# EAGLE board trig3_board_de0-nano (EAGLE 9.2.0), part 1 of 2
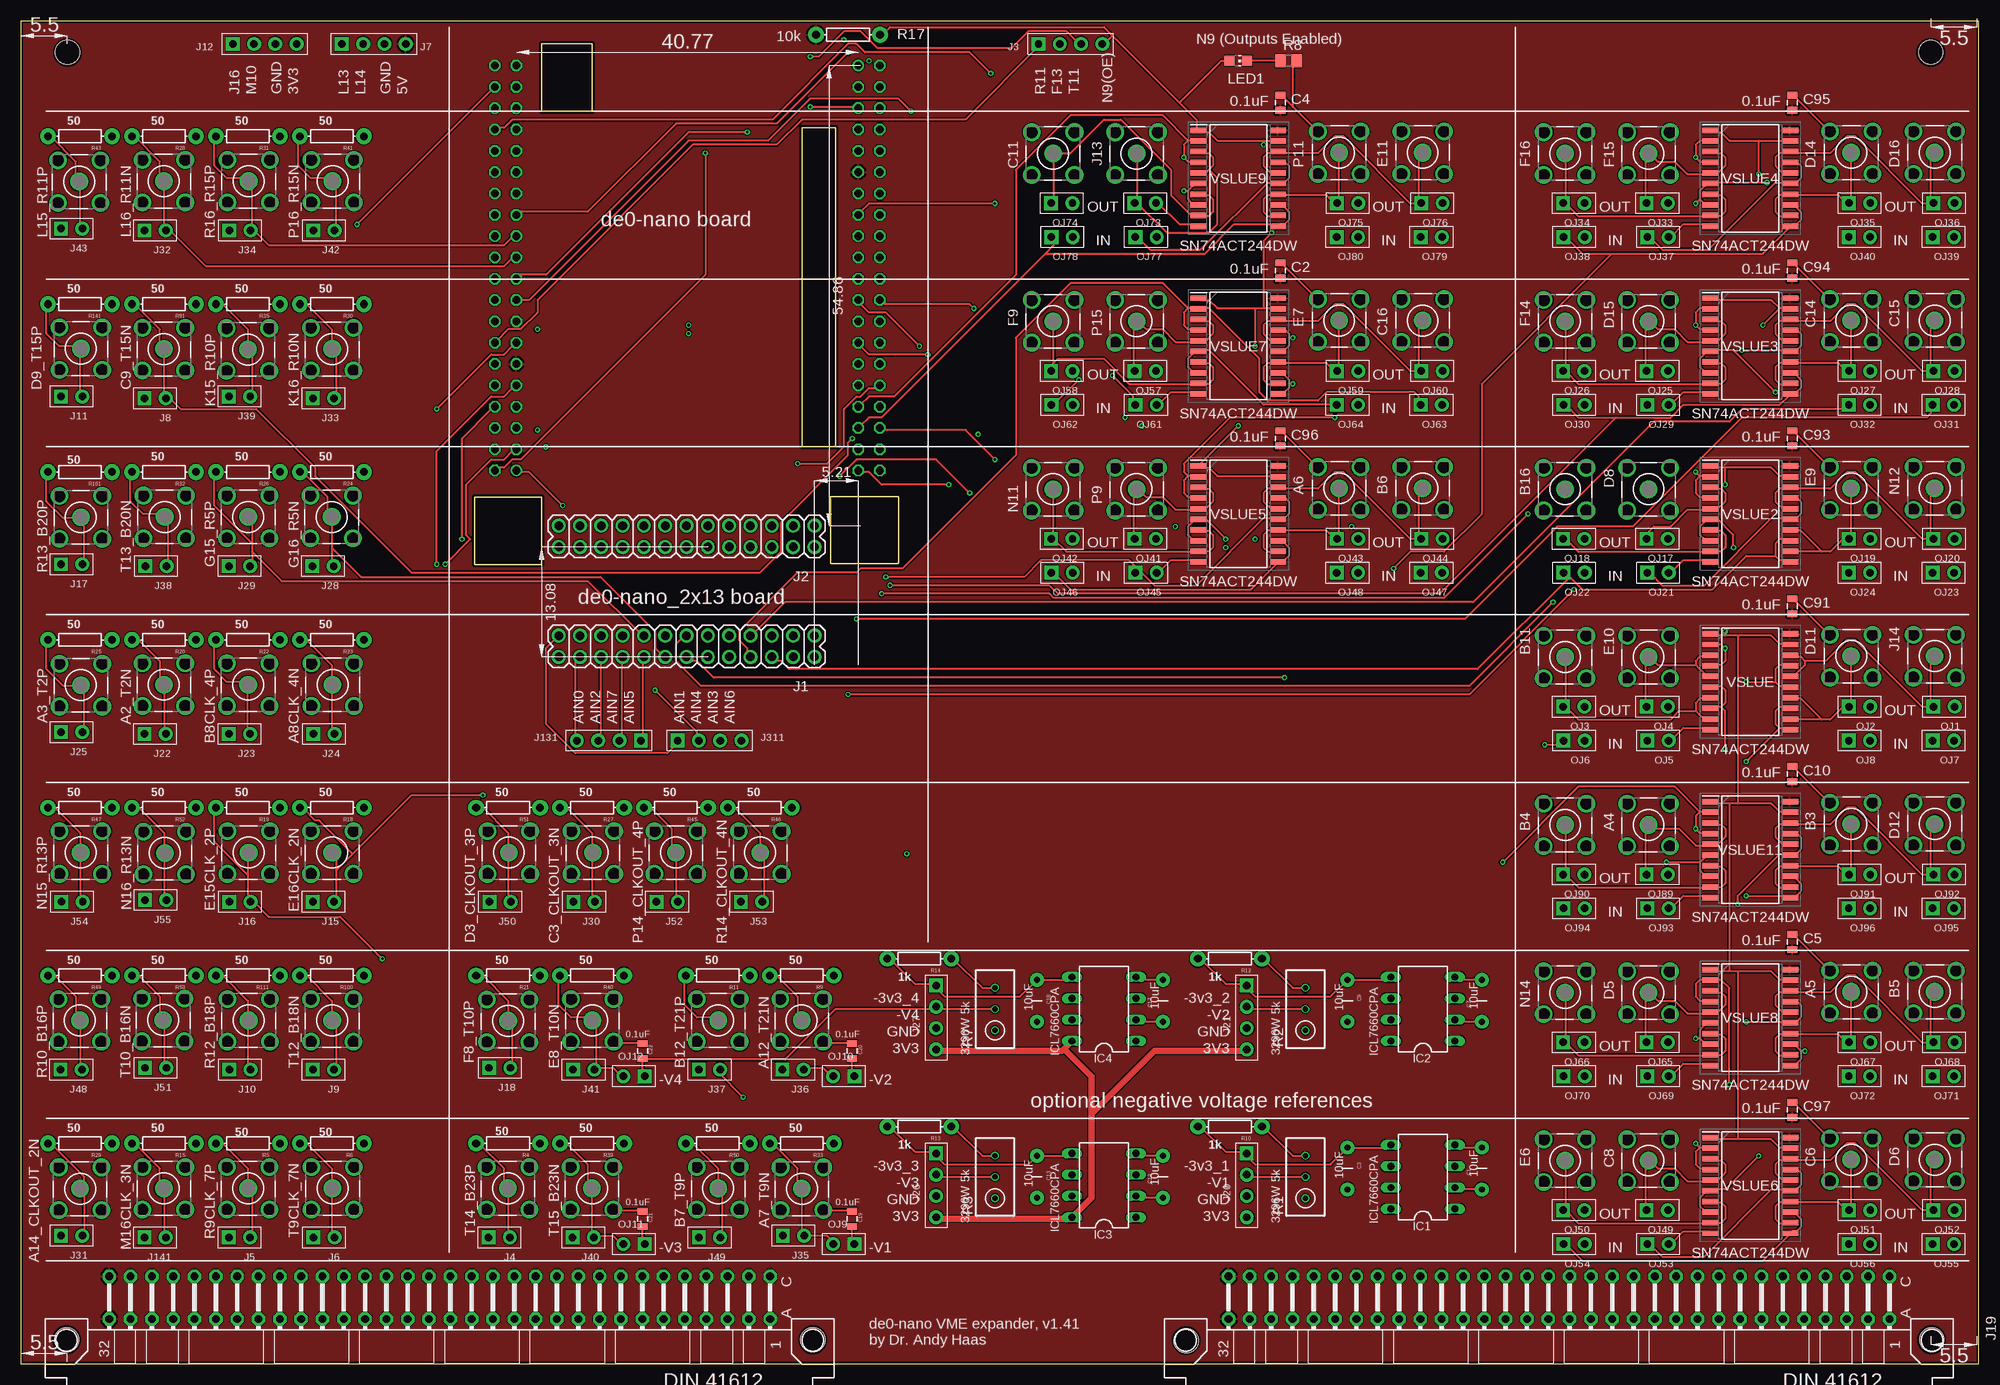
[diagram p5: board, top side]
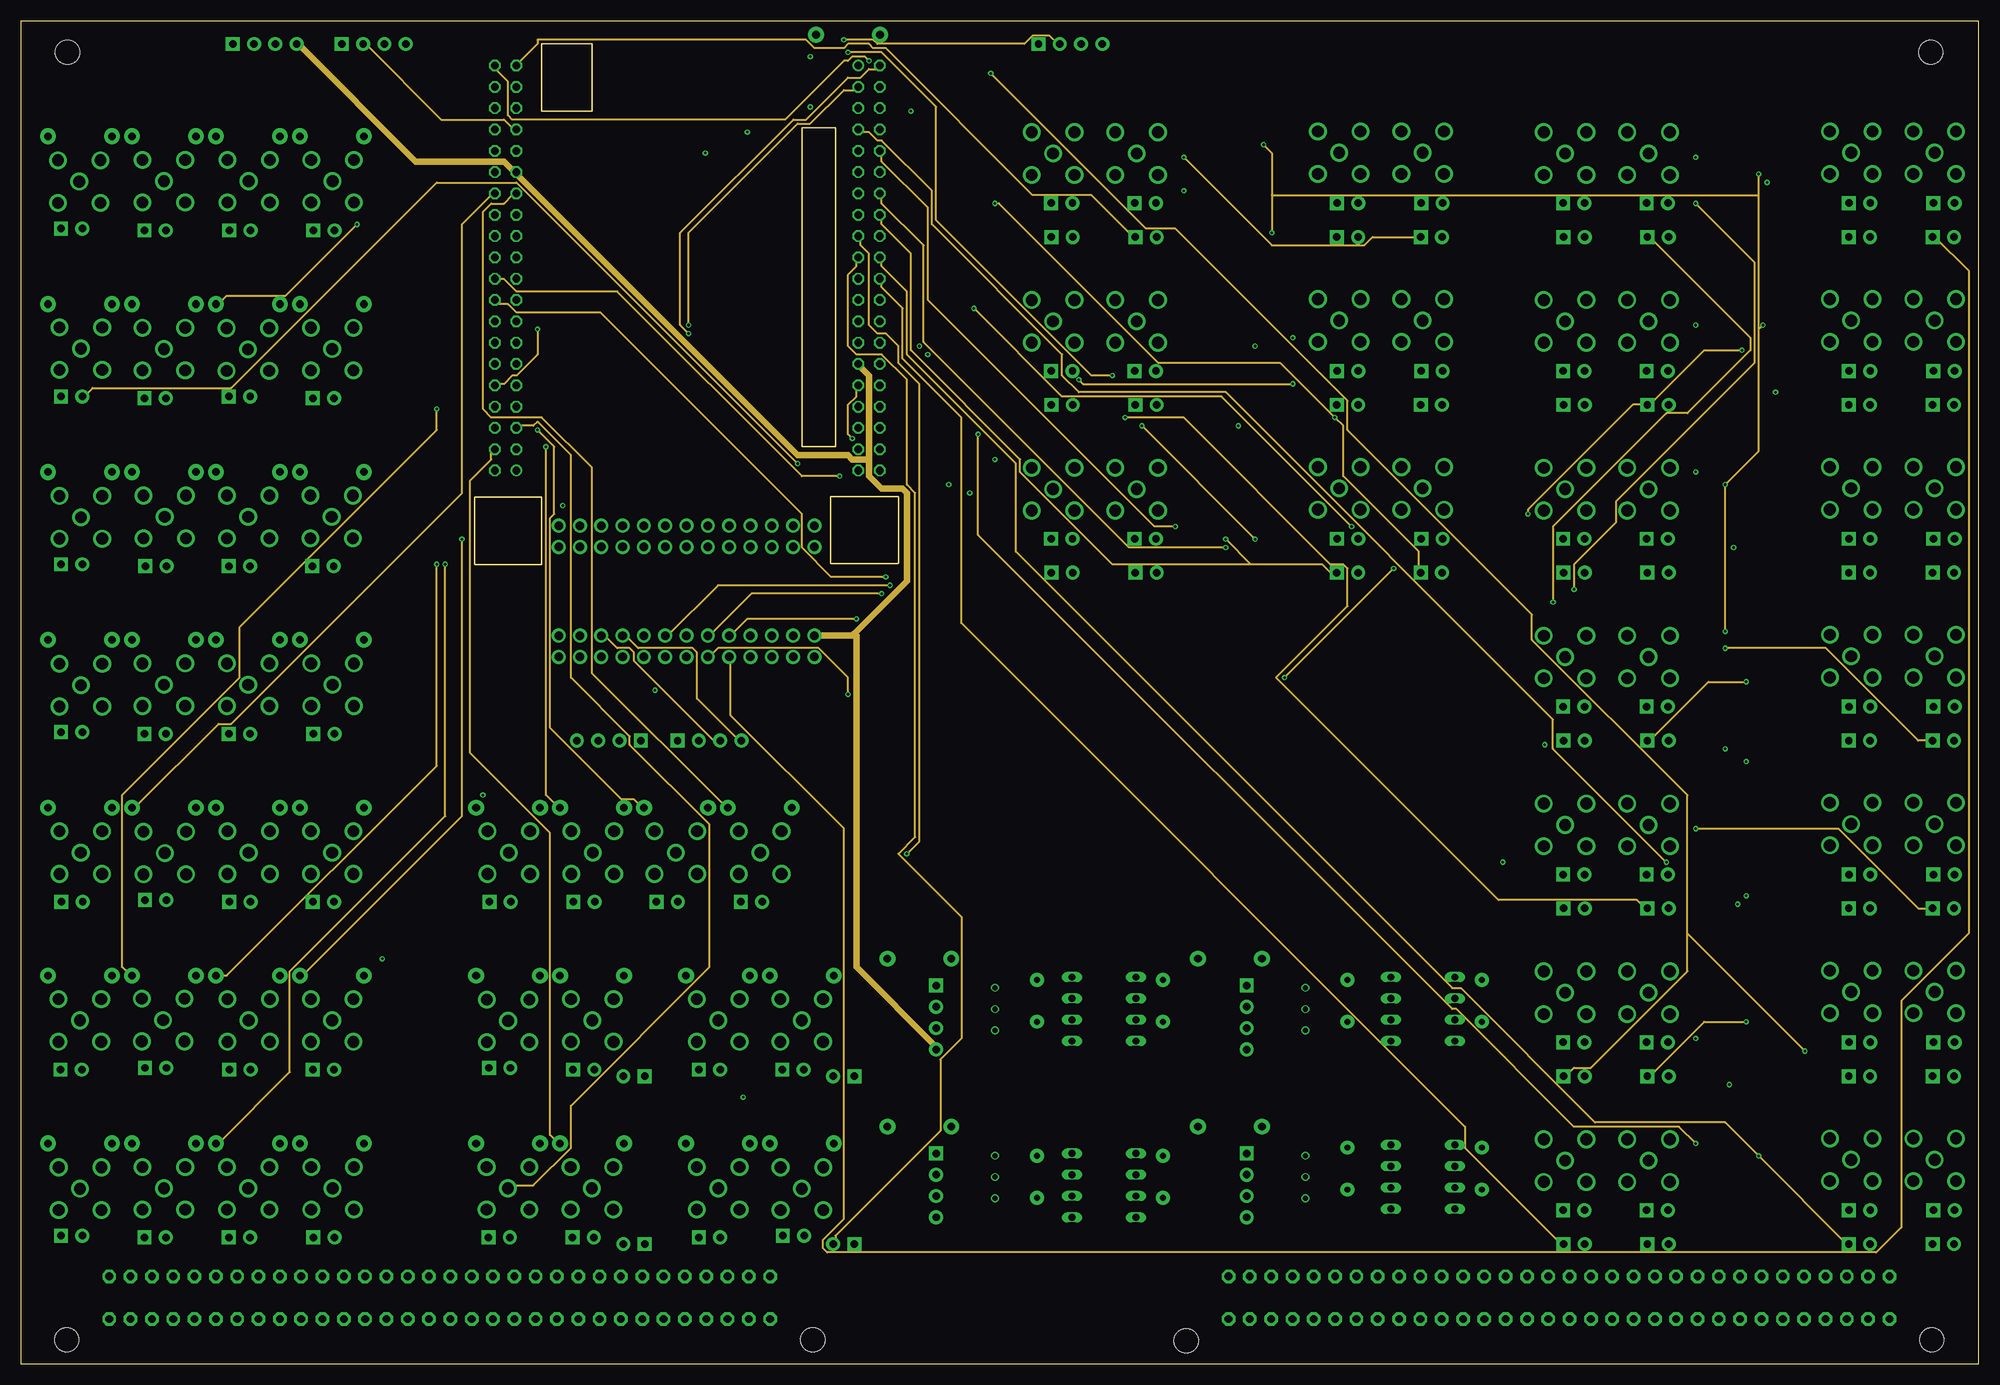
[diagram p6: board, inner layer Route2]
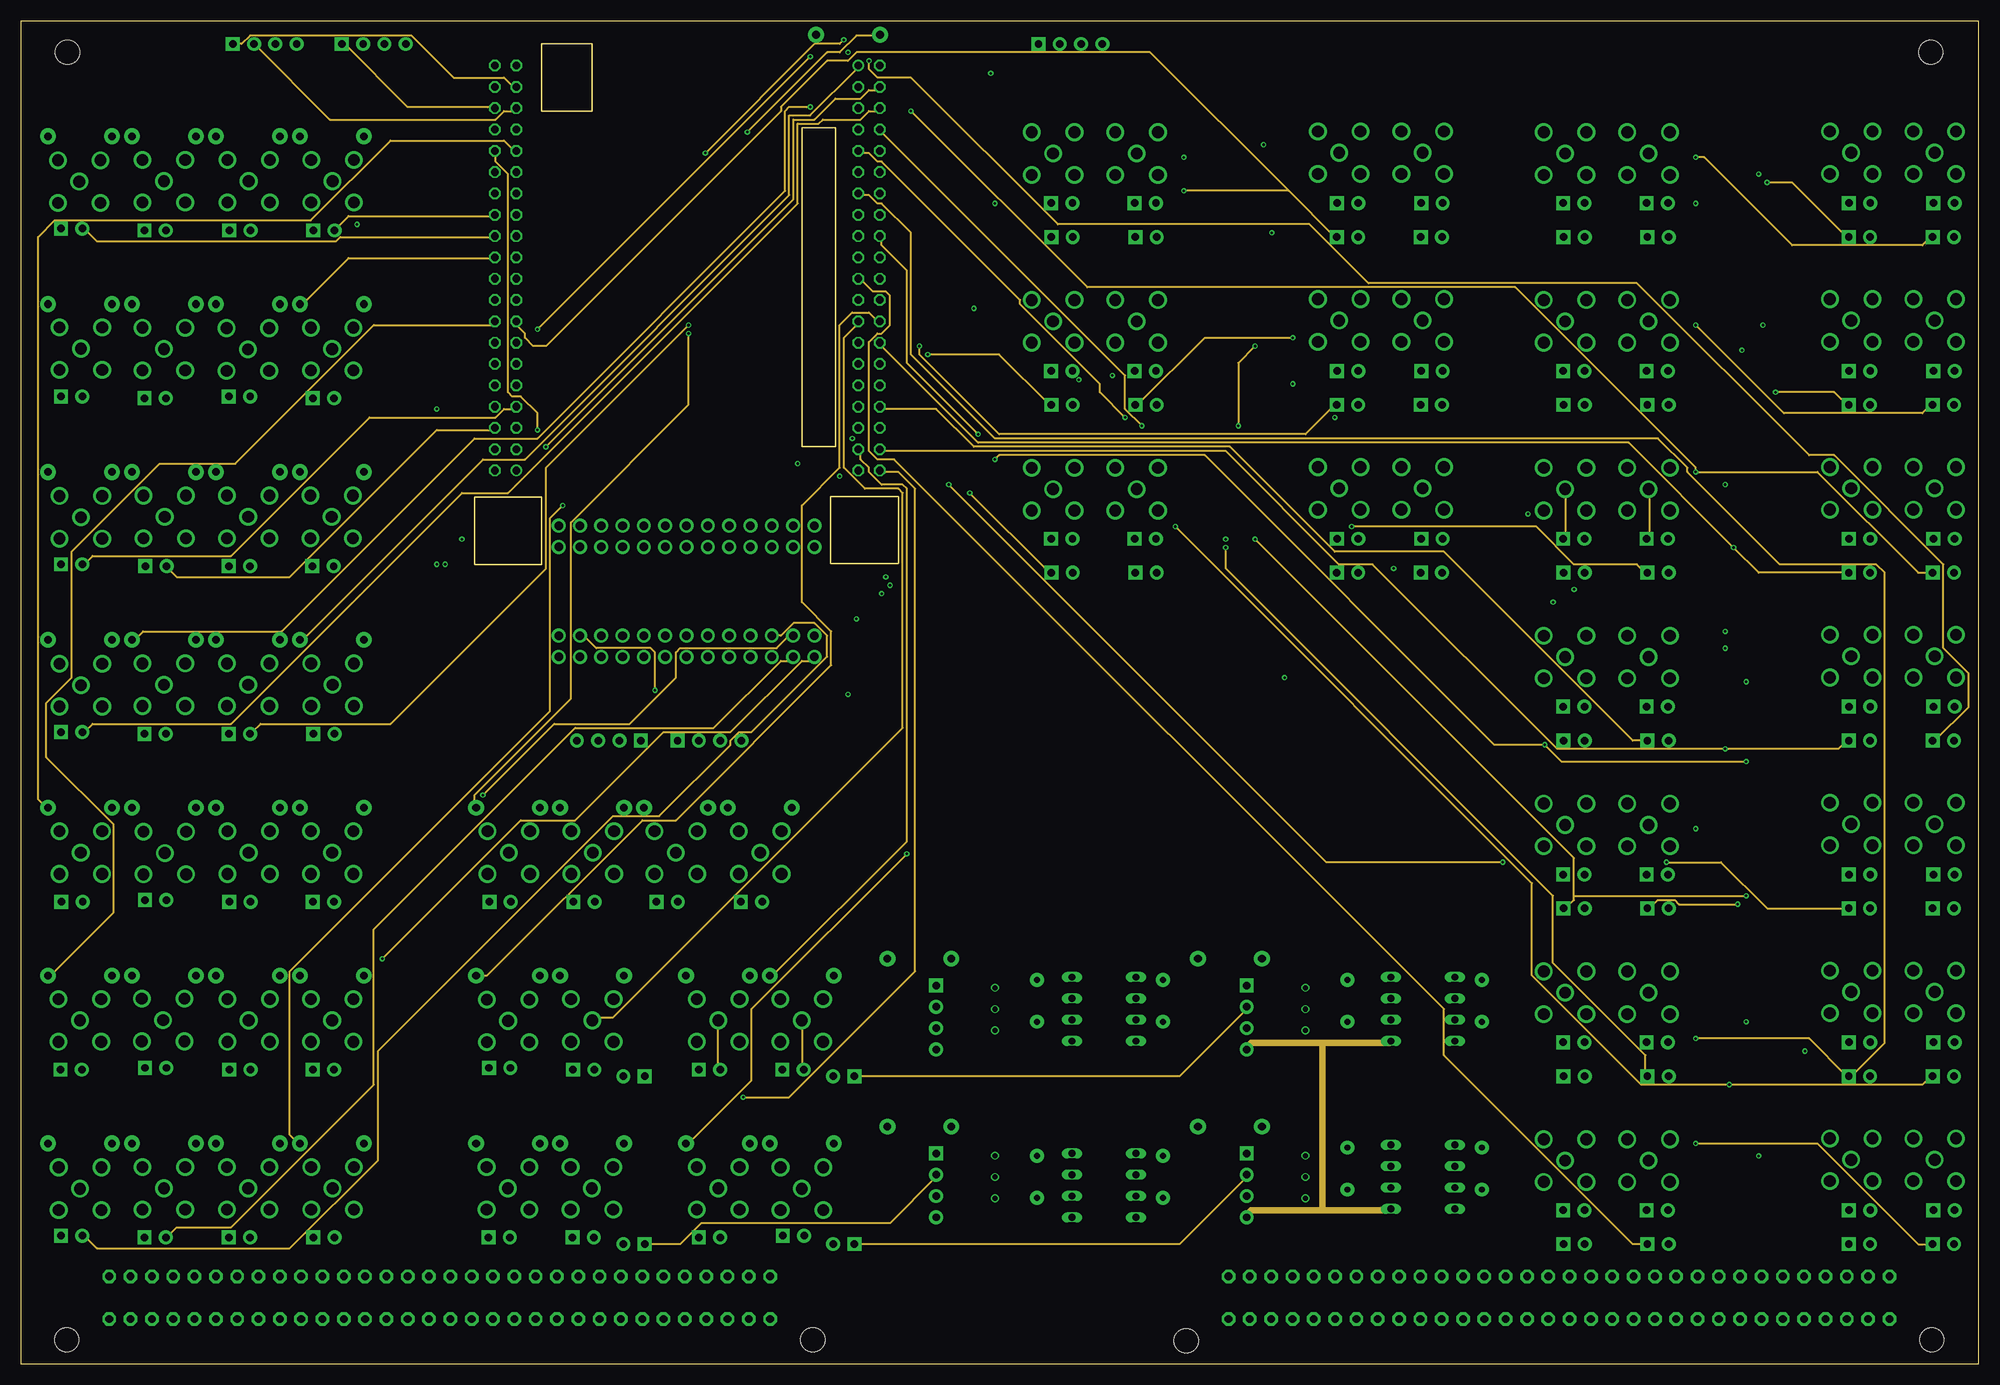
[diagram p7: board, inner layer Route15]
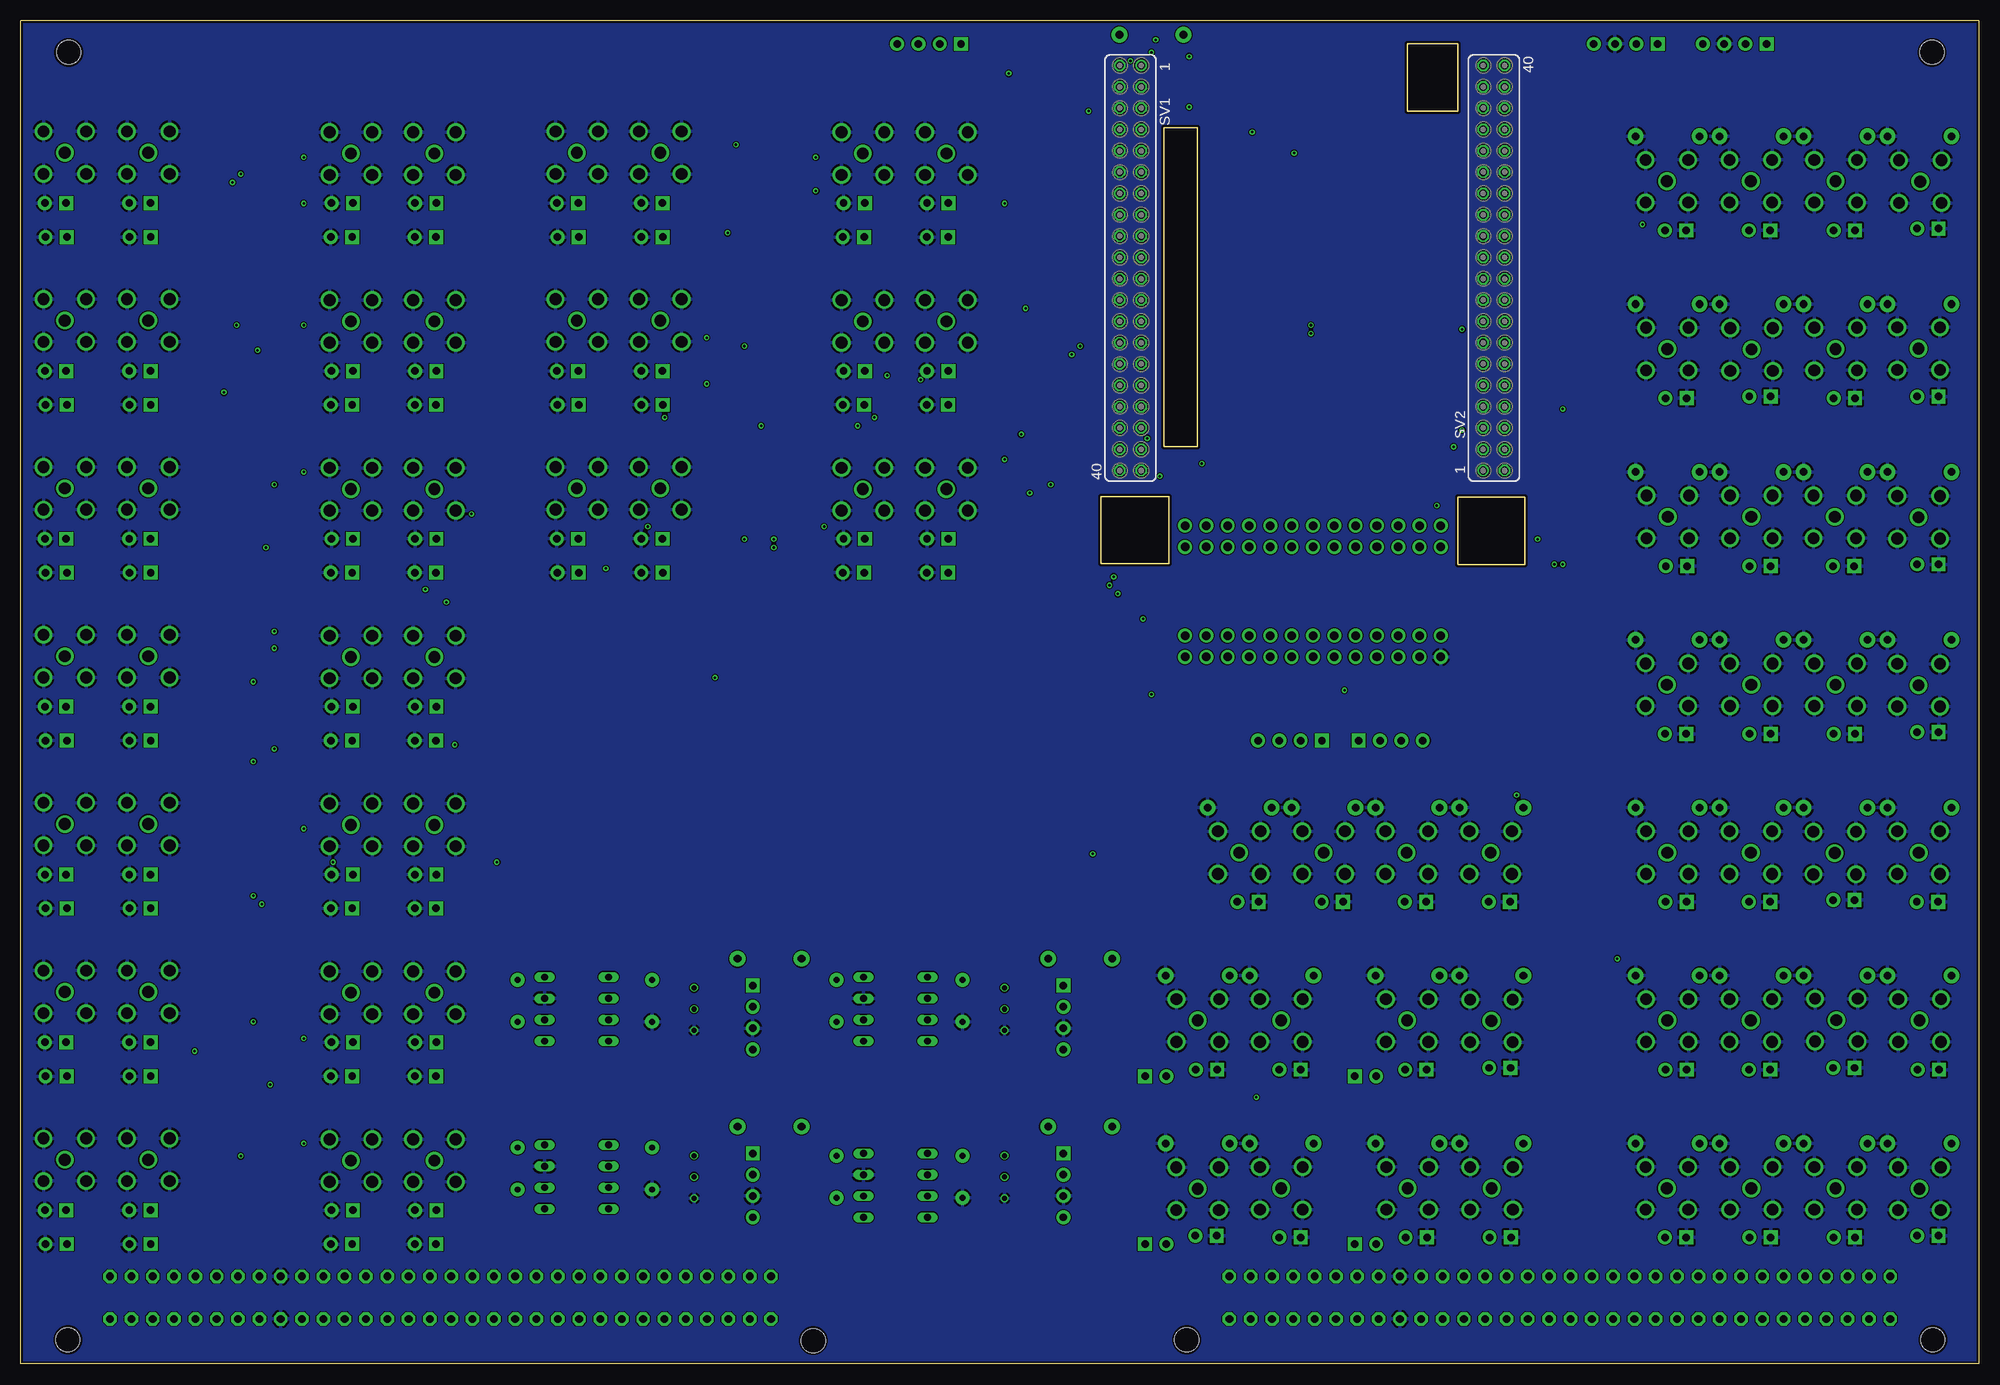
[diagram p8: board, bottom side, seen from below]

Size 233.22 x 160 mm. Coordinates in mm from the lower left corner, seen from the top.
Outline: 104.54,103.36 104.54,95.36 96.44,95.36 96.44,103.36 104.54,103.36
Outline: 62.04,103.26 62.04,95.26 54.04,95.26 54.04,103.26 62.04,103.26
Outline: 97.04,147.26 97.04,109.26 93.04,109.26 93.04,147.26 97.04,147.26
Outline: 62.04,149.26 62.04,157.26 68.04,157.26 68.04,149.26 62.04,149.26
Copper layers (1*2*15*16): Top 0.035mm / dielectric 0.23mm / Route2 0.035mm / dielectric 0.93mm / Route15 0.035mm / dielectric 0.23mm / Bottom 0.035mm
Design rules "MF_Standard_4_Layer": minimum track width 5mil, minimum drill 12mil, track to track 5mil, track to pad 5mil, pad to pad 5mil, via to via 5mil, smd to smd 0mil, copper to edge 10mil, drill to drill 10mil, minimum pad ring 6mil, minimum via ring 6mil, stop-mask expansion 2mil, vias tented up to drill 25mil, thermal gap 10mil
Net classes: 0 default: width 0.254 mm; 1 power: width 0.762 mm
Holes 2.9 mm at 5.44,2.86 138.84,2.76 227.64,2.86 94.34,2.86 5.54,156.26 227.54,156.26

## Footprints (pad centres in the part's own frame; a part is rotated, then mirrored left to right if it is on the bottom)
BU-SMB-V = drill 1.4: 1 0,0; 2 -2.54,2.54; 3 2.54,2.54; 4 2.54,-2.54; 5 -2.54,-2.54
CAP-PTH-5MM = drill 0.7 pad 1.651: 1 -2.5,0; 2 2.5,0
0805 = smd 0.8 x 1.2: 1 -0.9,0; 2 0.9,0
DIL08 = drill 0.813 long: 1 -3.81,-3.81; 2 -1.27,-3.81; 3 1.27,-3.81; 4 3.81,-3.81; 5 3.81,3.81; 6 1.27,3.81; 7 -1.27,3.81; 8 -3.81,3.81
2X13 = drill 1.016 pad 1.651: 1 0,0; 2 0,2.54; 3 2.54,0; 4 2.54,2.54; 5 5.08,0; 6 5.08,2.54; 7 7.62,0; 8 7.62,2.54; 9 10.16,0; 10 10.16,2.54; 11 12.7,0; 12 12.7,2.54; 13 15.24,0; 14 15.24,2.54; 15 17.78,0; 16 17.78,2.54; 17 20.32,0; 18 20.32,2.54; 19 22.86,0; 20 22.86,2.54; 21 25.4,0; 22 25.4,2.54; 23 27.94,0; 24 27.94,2.54; 25 30.48,0; 26 30.48,2.54
H4-2.54 = drill 0.889 pad 1.651 square: 1 0,3.81 | drill 0.889 pad 1.651: 2 0,1.27; 3 0,-1.27; 4 0,-3.81
H2-2.54 = drill 0.889 pad 1.651 square: 1 0,1.27 | drill 0.889 pad 1.651: 2 0,-1.27
6HE_160-VG64AC = drill 0.914 pad 1.6 octagon: 1-A1 5.08,11.43; 1-A2 5.08,16.51; 1-A3 5.08,13.97; 1-A4 5.08,19.05; 1-A5 5.08,21.59; 1-A6 5.08,24.13; 1-A7 5.08,26.67; 1-A8 5.08,29.21; 1-A9 5.08,31.75; 1-A10 5.08,34.29; 1-A11 5.08,36.83; 1-A12 5.08,39.37; 1-A13 5.08,41.91; 1-A14 5.08,44.45; 1-A15 5.08,46.99; 1-A16 5.08,49.53; 1-A17 5.08,52.07; 1-A18 5.08,54.61; 1-A19 5.08,57.15; 1-A20 5.08,59.69; 1-A21 5.08,62.23; 1-A22 5.08,64.77; 1-A23 5.08,67.31; 1-A24 5.08,69.85; 1-A25 5.08,72.39; 1-A26 5.08,74.93; 1-A27 5.08,77.47; 1-A28 5.08,80.01; 1-A29 5.08,82.55; 1-A30 5.08,85.09; 1-A31 5.08,87.63; 1-A32 5.08,90.17; 1-C1 10.16,11.43; 1-C2 10.16,13.97; 1-C3 10.16,16.51; 1-C4 10.16,19.05; 1-C5 10.16,21.59; 1-C6 10.16,24.13; 1-C7 10.16,26.67; 1-C8 10.16,29.21; 1-C9 10.16,31.75; 1-C10 10.16,34.29; 1-C11 10.16,36.83; 1-C12 10.16,39.37; 1-C13 10.16,41.91; 1-C14 10.16,44.45; 1-C15 10.16,46.99; 1-C16 10.16,49.53; 1-C17 10.16,52.07; 1-C18 10.16,54.61; 1-C19 10.16,57.15; 1-C20 10.16,59.69; 1-C21 10.16,62.23; 1-C22 10.16,64.77; 1-C23 10.16,67.31; 1-C24 10.16,69.85; 1-C25 10.16,72.39; 1-C26 10.16,74.93; 1-C27 10.16,77.47; 1-C28 10.16,80.01; 1-C29 10.16,82.55; 1-C30 10.16,85.09; 1-C31 10.16,87.63; 1-C32 10.16,90.17; 2-A1 5.08,144.78; 2-A2 5.08,147.32; 2-A3 5.08,149.86; 2-A4 5.08,152.4; 2-A5 5.08,154.94; 2-A6 5.08,157.48; 2-A7 5.08,160.02; 2-A8 5.08,162.56; 2-A9 5.08,165.1; 2-A10 5.08,167.64; 2-A11 5.08,170.18; 2-A12 5.08,172.72; 2-A13 5.08,175.26; 2-A14 5.08,177.8; 2-A15 5.08,180.34; 2-A16 5.08,182.88; 2-A17 5.08,185.42; 2-A18 5.08,187.96; 2-A19 5.08,190.5; 2-A20 5.08,193.04; 2-A21 5.08,195.58; 2-A22 5.08,198.12; 2-A23 5.08,200.66; 2-A24 5.08,203.2; 2-A25 5.08,205.74; 2-A26 5.08,208.28; 2-A27 5.08,210.82; 2-A28 5.08,213.36; 2-A29 5.08,215.9; 2-A30 5.08,218.44; 2-A31 5.08,220.98; 2-A32 5.08,223.52; 2-C1 10.16,144.78; 2-C2 10.16,147.32; 2-C3 10.16,149.86; 2-C4 10.16,152.4; 2-C5 10.16,154.94; 2-C6 10.16,157.48; 2-C7 10.16,160.02; 2-C8 10.16,162.56; 2-C9 10.16,165.1; 2-C10 10.16,167.64; 2-C11 10.16,170.18; 2-C12 10.16,172.72; 2-C13 10.16,175.26; 2-C14 10.16,177.8; 2-C15 10.16,180.34; 2-C16 10.16,182.88; 2-C17 10.16,185.42; 2-C18 10.16,187.96; 2-C19 10.16,190.5; 2-C20 10.16,193.04; 2-C21 10.16,195.58; 2-C22 10.16,198.12; 2-C23 10.16,200.66; 2-C24 10.16,203.2; 2-C25 10.16,205.74; 2-C26 10.16,208.28; 2-C27 10.16,210.82; 2-C28 10.16,213.36; 2-C29 10.16,215.9; 2-C30 10.16,218.44; 2-C31 10.16,220.98; 2-C32 10.16,223.52
CHIP-LED0805 = smd 1.2 x 1.2: A 0,-1.05; C 0,1.05
RTRIM3296W = drill 0.61: 1 0,-2.54; 2 0,0; 3 0,2.54
AXIAL-0.3 = drill 0.9 pad 1.88: P$1 -3.81,0; P$2 3.81,0
R0805 = smd 1.3 x 1.5: 1 -0.95,0; 2 0.95,0
FE20-2 = drill 0.914: 1 -24.13,1.27 | drill 0.914 octagon: 2 -24.13,-1.27; 3 -21.59,1.27; 4 -21.59,-1.27; 5 -19.05,1.27; 6 -19.05,-1.27; 7 -16.51,1.27; 8 -16.51,-1.27; 9 -13.97,1.27; 10 -13.97,-1.27; 11 -11.43,1.27; 12 -11.43,-1.27; 13 -8.89,1.27; 14 -8.89,-1.27; 15 -6.35,1.27; 16 -6.35,-1.27; 17 -3.81,1.27; 18 -3.81,-1.27; 19 -1.27,1.27; 20 -1.27,-1.27; 21 1.27,1.27; 22 1.27,-1.27; 23 3.81,1.27; 24 3.81,-1.27; 25 6.35,1.27; 26 6.35,-1.27; 27 8.89,1.27; 28 8.89,-1.27; 29 11.43,1.27; 30 11.43,-1.27; 31 13.97,1.27; 32 13.97,-1.27; 33 16.51,1.27; 34 16.51,-1.27; 35 19.05,1.27; 36 19.05,-1.27; 37 21.59,1.27; 38 21.59,-1.27; 39 24.13,1.27; 40 24.13,-1.27
SOIC127P1030X265-20N = smd 1.95 x 0.65: 1 -4.725,5.715; 2 -4.725,4.445; 3 -4.725,3.175; 4 -4.725,1.905; 5 -4.725,0.635; 6 -4.725,-0.635; 7 -4.725,-1.905; 8 -4.725,-3.175; 9 -4.725,-4.445; 10 -4.725,-5.715; 11 4.725,-5.715; 12 4.725,-4.445; 13 4.725,-3.175; 14 4.725,-1.905; 15 4.725,-0.635; 16 4.725,0.635; 17 4.725,1.905; 18 4.725,3.175; 19 4.725,4.445; 20 4.725,5.715

## Placement (x,y rotation side)
A2_T2N  BU-SMB-V  [BU-SMB-V]  17.02,80.91 180 top
A3_T2P  BU-SMB-V  [BU-SMB-V]  7.14,80.86 180 top
A4  BU-SMB-V  [BU-SMB-V]  193.92,64.21 180 top
A5  BU-SMB-V  [BU-SMB-V]  218.05,44.31 0 top
A6  BU-SMB-V  [BU-SMB-V]  157.05,104.31 0 top
A7_T9N  BU-SMB-V  [BU-SMB-V]  93.04,20.86 180 top
A8CLK_4N  BU-SMB-V  [BU-SMB-V]  37.12,80.91 180 top
A12_T21N  BU-SMB-V  [BU-SMB-V]  93.02,40.91 180 top
A14_CLKOUT_2N  BU-SMB-V  [BU-SMB-V]  7.04,20.86 180 top
B3  BU-SMB-V  [BU-SMB-V]  218.05,64.31 0 top
B4  BU-SMB-V  [BU-SMB-V]  183.97,64.21 180 top
B5  BU-SMB-V  [BU-SMB-V]  228,44.31 0 top
B6  BU-SMB-V  [BU-SMB-V]  167,104.31 0 top
B7_T9P  BU-SMB-V  [BU-SMB-V]  83.07,20.91 180 top
B8CLK_4P  BU-SMB-V  [BU-SMB-V]  27.07,80.91 180 top
B11  BU-SMB-V  [BU-SMB-V]  183.97,84.21 180 top
B12_T21P  BU-SMB-V  [BU-SMB-V]  83.07,40.91 180 top
B16  BU-SMB-V  [BU-SMB-V]  183.97,104.21 180 top
C1  10uF  [CAP-PTH-5MM]  174.04,23.26 90 top
C2  0.1uF  [0805]  150.04,130.26 270 top
C3  10uF  [CAP-PTH-5MM]  158.04,23.26 270 top
C3_CLKOUT_3N  BU-SMB-V  [BU-SMB-V]  68.12,60.91 180 top
C4  0.1uF  [0805]  150.04,150.26 270 top
C5  0.1uF  [0805]  211.04,50.26 270 top
C6  BU-SMB-V  [BU-SMB-V]  218.05,24.31 0 top
C7  10uF  [CAP-PTH-5MM]  174.04,43.26 90 top
C8  BU-SMB-V  [BU-SMB-V]  193.92,24.21 180 top
C9  10uF  [CAP-PTH-5MM]  158.04,43.26 270 top
C9_T15N  BU-SMB-V  [BU-SMB-V]  17.02,120.91 180 top
C10  0.1uF  [0805]  211.04,70.26 270 top
C11  BU-SMB-V  [BU-SMB-V]  122.97,144.21 180 top
C12  10uF  [CAP-PTH-5MM]  136.04,22.26 90 top
C13  10uF  [CAP-PTH-5MM]  121.04,22.26 270 top
C14  BU-SMB-V  [BU-SMB-V]  218.05,124.31 0 top
C15  BU-SMB-V  [BU-SMB-V]  228,124.31 0 top
C16  BU-SMB-V  [BU-SMB-V]  167,124.31 0 top
C17  10uF  [CAP-PTH-5MM]  136.04,43.26 90 top
C18  10uF  [CAP-PTH-5MM]  121.04,43.26 270 top
C19  0.1uF  [0805]  99.04,17.26 270 top
C20  0.1uF  [0805]  99.04,37.26 270 top
C21  0.1uF  [0805]  74.04,17.26 270 top
C22  0.1uF  [0805]  74.04,37.26 270 top
C91  0.1uF  [0805]  211.04,90.26 270 top
C93  0.1uF  [0805]  211.04,110.26 270 top
C94  0.1uF  [0805]  211.04,130.26 270 top
C95  0.1uF  [0805]  211.04,150.26 270 top
C96  0.1uF  [0805]  150.04,110.26 270 top
C97  0.1uF  [0805]  211.04,30.26 270 top
D3_CLKOUT_3P  BU-SMB-V  [BU-SMB-V]  58.12,60.91 180 top
D5  BU-SMB-V  [BU-SMB-V]  193.92,44.21 180 top
D6  BU-SMB-V  [BU-SMB-V]  228,24.31 0 top
D8  BU-SMB-V  [BU-SMB-V]  193.92,104.21 180 top
D9_T15P  BU-SMB-V  [BU-SMB-V]  7.14,120.96 180 top
D11  BU-SMB-V  [BU-SMB-V]  218.05,84.31 0 top
D12  BU-SMB-V  [BU-SMB-V]  228,64.31 0 top
D14  BU-SMB-V  [BU-SMB-V]  218.05,144.31 0 top
D15  BU-SMB-V  [BU-SMB-V]  193.92,124.21 180 top
D16  BU-SMB-V  [BU-SMB-V]  228,144.31 0 top
E6  BU-SMB-V  [BU-SMB-V]  183.97,24.21 180 top
E7  BU-SMB-V  [BU-SMB-V]  157.05,124.31 0 top
E8_T10N  BU-SMB-V  [BU-SMB-V]  68.07,40.91 180 top
E9  BU-SMB-V  [BU-SMB-V]  218.05,104.31 0 top
E10  BU-SMB-V  [BU-SMB-V]  193.92,84.21 180 top
E11  BU-SMB-V  [BU-SMB-V]  167,144.31 0 top
E15CLK_2P  BU-SMB-V  [BU-SMB-V]  27.12,60.91 180 top
E16CLK_2N  BU-SMB-V  [BU-SMB-V]  37.07,60.91 180 top
F8_T10P  BU-SMB-V  [BU-SMB-V]  58.04,40.86 180 top
F9  BU-SMB-V  [BU-SMB-V]  122.97,124.21 180 top
F14  BU-SMB-V  [BU-SMB-V]  183.97,124.21 180 top
F15  BU-SMB-V  [BU-SMB-V]  193.92,144.21 180 top
F16  BU-SMB-V  [BU-SMB-V]  183.97,144.21 180 top
G15_R5P  BU-SMB-V  [BU-SMB-V]  27.07,100.91 180 top
G16_R5N  BU-SMB-V  [BU-SMB-V]  37.02,100.91 180 top
IC1  ICL7660CPA  [DIL08]  167.04,22.26 90 top
IC2  ICL7660CPA  [DIL08]  167.04,42.26 90 top
IC3  ICL7660CPA  [DIL08]  129.04,21.26 90 top
IC4  ICL7660CPA  [DIL08]  129.04,42.26 90 top
J1  [2X13]  94.54,86.76 180 top
J2  [2X13]  94.54,99.86 180 top
J3  4p-2.54  [H4-2.54]  125.04,157.26 90 top
J4  2p-2.54  [H2-2.54]  56.98,15.05 90 top
J5  2p-2.54  [H2-2.54]  26.03,15.05 90 top
J6  2p-2.54  [H2-2.54]  36.09,15.05 90 top
J7  4p-2.54  [H4-2.54]  42.04,157.26 90 top
J8  2p-2.54  [H2-2.54]  15.98,115.05 90 top
J9  2p-2.54  [H2-2.54]  36.03,35.05 90 top
J10  2p-2.54  [H2-2.54]  26.09,35.05 90 top
J11  2p-2.54  [H2-2.54]  6.04,115.26 90 top
J12  4p-2.54  [H4-2.54]  29.04,157.26 90 top
J13  BU-SMB-V  [BU-SMB-V]  132.92,144.21 180 top
J14  BU-SMB-V  [BU-SMB-V]  228,84.31 0 top
J15  2p-2.54  [H2-2.54]  36.03,55.05 90 top
J16  2p-2.54  [H2-2.54]  26.09,55.05 90 top
J17  2p-2.54  [H2-2.54]  6.04,95.26 90 top
J18  2p-2.54  [H2-2.54]  57.04,35.26 90 top
J19  6HE-160-VG64AC  [6HE_160-VG64AC]  234.04,0.26 90 top
J20  4p-2.54  [H4-2.54]  146.04,21.26 0 top
J21  4p-2.54  [H4-2.54]  146.04,41.26 0 top
J22  2p-2.54  [H2-2.54]  15.98,75.05 90 top
J23  2p-2.54  [H2-2.54]  26.03,75.05 90 top
J24  2p-2.54  [H2-2.54]  36.09,75.05 90 top
J25  2p-2.54  [H2-2.54]  6.04,75.26 90 top
J26  4p-2.54  [H4-2.54]  109.04,21.26 0 top
J27  4p-2.54  [H4-2.54]  109.04,41.26 0 top
J28  2p-2.54  [H2-2.54]  35.98,95.05 90 top
J29  2p-2.54  [H2-2.54]  26.03,95.05 90 top
J30  2p-2.54  [H2-2.54]  67.09,55.05 90 top
J31  2p-2.54  [H2-2.54]  6.04,15.26 90 top
J32  2p-2.54  [H2-2.54]  15.98,135.05 90 top
J33  2p-2.54  [H2-2.54]  36.03,115.05 90 top
J34  2p-2.54  [H2-2.54]  26.09,135.05 90 top
J35  2p-2.54  [H2-2.54]  92.04,15.26 90 top
J36  2p-2.54  [H2-2.54]  91.98,35.05 90 top
J37  2p-2.54  [H2-2.54]  82.03,35.05 90 top
J38  2p-2.54  [H2-2.54]  16.09,95.05 90 top
J39  2p-2.54  [H2-2.54]  26.04,115.26 90 top
J40  2p-2.54  [H2-2.54]  66.98,15.05 90 top
J41  2p-2.54  [H2-2.54]  67.03,35.05 90 top
J42  2p-2.54  [H2-2.54]  36.09,135.05 90 top
J43  2p-2.54  [H2-2.54]  6.04,135.26 90 top
J48  2p-2.54  [H2-2.54]  5.98,35.05 90 top
J49  2p-2.54  [H2-2.54]  82.03,15.05 90 top
J50  2p-2.54  [H2-2.54]  57.09,55.05 90 top
J51  2p-2.54  [H2-2.54]  16.04,35.26 90 top
J52  2p-2.54  [H2-2.54]  76.98,55.05 90 top
J53  2p-2.54  [H2-2.54]  87.03,55.05 90 top
J54  2p-2.54  [H2-2.54]  6.09,55.05 90 top
J55  2p-2.54  [H2-2.54]  16.04,55.26 90 top
J131  4p-2.54  [H4-2.54]  70.04,74.26 270 top
J141  2p-2.54  [H2-2.54]  15.98,15.05 90 top
J311  4p-2.54  [H4-2.54]  82.04,74.26 90 top
K15_R10P  BU-SMB-V  [BU-SMB-V]  27.04,120.86 180 top
K16_R10N  BU-SMB-V  [BU-SMB-V]  37.07,120.91 180 top
L15_R11P  BU-SMB-V  [BU-SMB-V]  6.94,140.86 180 top
L16_R11N  BU-SMB-V  [BU-SMB-V]  17.02,140.91 180 top
LED1  red  [CHIP-LED0805]  145.04,155.26 270 top
M16CLK_3N  BU-SMB-V  [BU-SMB-V]  17.02,20.91 180 top
N11  BU-SMB-V  [BU-SMB-V]  122.97,104.21 180 top
N12  BU-SMB-V  [BU-SMB-V]  228,104.31 0 top
N14  BU-SMB-V  [BU-SMB-V]  183.97,44.21 180 top
N15_R13P  BU-SMB-V  [BU-SMB-V]  7.12,60.91 180 top
N16_R13N  BU-SMB-V  [BU-SMB-V]  17.14,60.86 180 top
OJ1  2p-2.54  [H2-2.54]  229.11,78.3 90 top
OJ2  2p-2.54  [H2-2.54]  219.06,78.3 90 top
OJ3  2p-2.54  [H2-2.54]  185,78.3 90 top
OJ4  2p-2.54  [H2-2.54]  194.95,78.3 90 top
OJ5  2p-2.54  [H2-2.54]  195.04,74.26 90 top
OJ6  2p-2.54  [H2-2.54]  185.04,74.26 90 top
OJ7  2p-2.54  [H2-2.54]  229.04,74.26 90 top
OJ8  2p-2.54  [H2-2.54]  219.04,74.26 90 top
OJ9  2p-2.54  [H2-2.54]  98.04,14.26 270 top
OJ10  2p-2.54  [H2-2.54]  98.04,34.26 270 top
OJ11  2p-2.54  [H2-2.54]  73.04,14.26 270 top
OJ12  2p-2.54  [H2-2.54]  73.04,34.26 270 top
OJ17  2p-2.54  [H2-2.54]  194.95,98.3 90 top
OJ18  2p-2.54  [H2-2.54]  185,98.3 90 top
OJ19  2p-2.54  [H2-2.54]  219.06,98.3 90 top
OJ20  2p-2.54  [H2-2.54]  229.11,98.3 90 top
OJ21  2p-2.54  [H2-2.54]  195.04,94.26 90 top
OJ22  2p-2.54  [H2-2.54]  185.04,94.26 90 top
OJ23  2p-2.54  [H2-2.54]  229.04,94.26 90 top
OJ24  2p-2.54  [H2-2.54]  219.04,94.26 90 top
OJ25  2p-2.54  [H2-2.54]  194.95,118.3 90 top
OJ26  2p-2.54  [H2-2.54]  185,118.3 90 top
OJ27  2p-2.54  [H2-2.54]  219.06,118.3 90 top
OJ28  2p-2.54  [H2-2.54]  229.11,118.3 90 top
OJ29  2p-2.54  [H2-2.54]  195.04,114.26 90 top
OJ30  2p-2.54  [H2-2.54]  185.04,114.26 90 top
OJ31  2p-2.54  [H2-2.54]  229.04,114.26 90 top
OJ32  2p-2.54  [H2-2.54]  219.04,114.26 90 top
OJ33  2p-2.54  [H2-2.54]  194.95,138.3 90 top
OJ34  2p-2.54  [H2-2.54]  185,138.3 90 top
OJ35  2p-2.54  [H2-2.54]  219.06,138.3 90 top
OJ36  2p-2.54  [H2-2.54]  229.11,138.3 90 top
OJ37  2p-2.54  [H2-2.54]  195.04,134.26 90 top
OJ38  2p-2.54  [H2-2.54]  185.04,134.26 90 top
OJ39  2p-2.54  [H2-2.54]  229.04,134.26 90 top
OJ40  2p-2.54  [H2-2.54]  219.04,134.26 90 top
OJ41  2p-2.54  [H2-2.54]  133.95,98.3 90 top
OJ42  2p-2.54  [H2-2.54]  124,98.3 90 top
OJ43  2p-2.54  [H2-2.54]  158.06,98.3 90 top
OJ44  2p-2.54  [H2-2.54]  168.11,98.3 90 top
OJ45  2p-2.54  [H2-2.54]  134.04,94.26 90 top
OJ46  2p-2.54  [H2-2.54]  124.04,94.26 90 top
OJ47  2p-2.54  [H2-2.54]  168.04,94.26 90 top
OJ48  2p-2.54  [H2-2.54]  158.04,94.26 90 top
OJ49  2p-2.54  [H2-2.54]  194.95,18.3 90 top
OJ50  2p-2.54  [H2-2.54]  185,18.3 90 top
OJ51  2p-2.54  [H2-2.54]  219.06,18.3 90 top
OJ52  2p-2.54  [H2-2.54]  229.11,18.3 90 top
OJ53  2p-2.54  [H2-2.54]  195.04,14.26 90 top
OJ54  2p-2.54  [H2-2.54]  185.04,14.26 90 top
OJ55  2p-2.54  [H2-2.54]  229.04,14.26 90 top
OJ56  2p-2.54  [H2-2.54]  219.04,14.26 90 top
OJ57  2p-2.54  [H2-2.54]  133.95,118.3 90 top
OJ58  2p-2.54  [H2-2.54]  124,118.3 90 top
OJ59  2p-2.54  [H2-2.54]  158.06,118.3 90 top
OJ60  2p-2.54  [H2-2.54]  168.11,118.3 90 top
OJ61  2p-2.54  [H2-2.54]  134.04,114.26 90 top
OJ62  2p-2.54  [H2-2.54]  124.04,114.26 90 top
OJ63  2p-2.54  [H2-2.54]  168.04,114.26 90 top
OJ64  2p-2.54  [H2-2.54]  158.04,114.26 90 top
OJ65  2p-2.54  [H2-2.54]  194.95,38.3 90 top
OJ66  2p-2.54  [H2-2.54]  185,38.3 90 top
OJ67  2p-2.54  [H2-2.54]  219.06,38.3 90 top
OJ68  2p-2.54  [H2-2.54]  229.11,38.3 90 top
OJ69  2p-2.54  [H2-2.54]  195.04,34.26 90 top
OJ70  2p-2.54  [H2-2.54]  185.04,34.26 90 top
OJ71  2p-2.54  [H2-2.54]  229.04,34.26 90 top
OJ72  2p-2.54  [H2-2.54]  219.04,34.26 90 top
OJ73  2p-2.54  [H2-2.54]  133.95,138.3 90 top
OJ74  2p-2.54  [H2-2.54]  124,138.3 90 top
OJ75  2p-2.54  [H2-2.54]  158.06,138.3 90 top
OJ76  2p-2.54  [H2-2.54]  168.11,138.3 90 top
OJ77  2p-2.54  [H2-2.54]  134.04,134.26 90 top
OJ78  2p-2.54  [H2-2.54]  124.04,134.26 90 top
OJ79  2p-2.54  [H2-2.54]  168.04,134.26 90 top
OJ80  2p-2.54  [H2-2.54]  158.04,134.26 90 top
OJ89  2p-2.54  [H2-2.54]  194.95,58.3 90 top
OJ90  2p-2.54  [H2-2.54]  185,58.3 90 top
OJ91  2p-2.54  [H2-2.54]  219.06,58.3 90 top
OJ92  2p-2.54  [H2-2.54]  229.11,58.3 90 top
OJ93  2p-2.54  [H2-2.54]  195.04,54.26 90 top
OJ94  2p-2.54  [H2-2.54]  185.04,54.26 90 top
OJ95  2p-2.54  [H2-2.54]  229.04,54.26 90 top
OJ96  2p-2.54  [H2-2.54]  219.04,54.26 90 top
P9  BU-SMB-V  [BU-SMB-V]  132.92,104.21 180 top
P11  BU-SMB-V  [BU-SMB-V]  157.05,144.31 0 top
P14_CLKOUT_4P  BU-SMB-V  [BU-SMB-V]  78.02,60.91 180 top
P15  BU-SMB-V  [BU-SMB-V]  132.92,124.21 180 top
P16_R15N  BU-SMB-V  [BU-SMB-V]  37.12,140.91 180 top
R1  3296W 5k  [RTRIM3296W]  153.04,22.26 0 top
R2  3296W 5k  [RTRIM3296W]  153.04,42.26 0 top
R3  3296W 5k  [RTRIM3296W]  116.04,22.26 0 top
R4  50  [AXIAL-0.3]  58.04,26.26 180 top
R5  50  [AXIAL-0.3]  27.04,26.26 180 top
R6  50  [AXIAL-0.3]  37.04,26.26 180 top
R7  3296W 5k  [RTRIM3296W]  116.04,42.26 0 top
R8  560  [R0805]  151.04,155.26 0 top
R9  50  [AXIAL-0.3]  93.04,46.26 180 top
R9CLK_7P  BU-SMB-V  [BU-SMB-V]  27.07,20.91 180 top
R10  1k  [AXIAL-0.3]  144.04,28.26 180 top
R10_B16P  BU-SMB-V  [BU-SMB-V]  7.02,40.91 180 top
R11  50  [AXIAL-0.3]  83.04,46.26 180 top
R12  1k  [AXIAL-0.3]  144.04,48.26 180 top
R12_B18P  BU-SMB-V  [BU-SMB-V]  27.12,40.91 180 top
R13  1k  [AXIAL-0.3]  107.04,28.26 180 top
R13_B20P  BU-SMB-V  [BU-SMB-V]  7.14,100.86 180 top
R14  1k  [AXIAL-0.3]  107.04,48.26 180 top
R14_CLKOUT_4N  BU-SMB-V  [BU-SMB-V]  88.07,60.91 180 top
R15  50  [AXIAL-0.3]  17.04,26.26 180 top
R16_R15P  BU-SMB-V  [BU-SMB-V]  27.12,140.91 180 top
R17  10k  [AXIAL-0.3]  98.54,158.36 0 top
R18  50  [AXIAL-0.3]  37.04,66.26 180 top
R19  50  [AXIAL-0.3]  27.04,66.26 180 top
R20  50  [AXIAL-0.3]  17.04,86.26 180 top
R21  50  [AXIAL-0.3]  58.04,46.26 180 top
R22  50  [AXIAL-0.3]  27.04,86.26 180 top
R23  50  [AXIAL-0.3]  37.04,86.26 180 top
R24  50  [AXIAL-0.3]  37.04,106.26 180 top
R25  50  [AXIAL-0.3]  7.04,86.26 180 top
R26  50  [AXIAL-0.3]  27.04,106.26 180 top
R27  50  [AXIAL-0.3]  68.04,66.26 180 top
R28  50  [AXIAL-0.3]  17.04,146.26 180 top
R29  50  [AXIAL-0.3]  7.04,26.26 180 top
R30  50  [AXIAL-0.3]  37.04,126.26 180 top
R31  50  [AXIAL-0.3]  27.04,146.26 180 top
R32  50  [AXIAL-0.3]  17.04,106.26 180 top
R33  50  [AXIAL-0.3]  93.04,26.26 180 top
R35  50  [AXIAL-0.3]  27.04,126.26 180 top
R39  50  [AXIAL-0.3]  68.04,26.26 180 top
R40  50  [AXIAL-0.3]  68.04,46.26 180 top
R41  50  [AXIAL-0.3]  37.04,146.26 180 top
R43  50  [AXIAL-0.3]  7.04,146.26 180 top
R45  50  [AXIAL-0.3]  78.04,66.26 180 top
R46  50  [AXIAL-0.3]  88.04,66.26 180 top
R47  50  [AXIAL-0.3]  7.04,66.26 180 top
R49  50  [AXIAL-0.3]  7.04,46.26 180 top
R50  50  [AXIAL-0.3]  83.04,26.26 180 top
R51  50  [AXIAL-0.3]  58.04,66.26 180 top
R52  50  [AXIAL-0.3]  17.04,66.26 180 top
R53  50  [AXIAL-0.3]  17.04,46.26 180 top
R91  50  [AXIAL-0.3]  17.04,126.26 180 top
R100  50  [AXIAL-0.3]  37.04,46.26 180 top
R111  50  [AXIAL-0.3]  27.04,46.26 180 top
R141  50  [AXIAL-0.3]  7.04,126.26 180 top
R161  50  [AXIAL-0.3]  7.04,106.26 180 top
SV1  [FE20-2]  101.04,130.56 270 bottom
SV2  [FE20-2]  57.74,130.56 90 bottom
T9CLK_7N  BU-SMB-V  [BU-SMB-V]  37.12,20.91 180 top
T10_B16N  BU-SMB-V  [BU-SMB-V]  16.94,40.96 180 top
T12_B18N  BU-SMB-V  [BU-SMB-V]  37.07,40.91 180 top
T13_B20N  BU-SMB-V  [BU-SMB-V]  17.12,100.91 180 top
T14_B23P  BU-SMB-V  [BU-SMB-V]  58.02,20.91 180 top
T15_B23N  BU-SMB-V  [BU-SMB-V]  68.02,20.91 180 top
VSLUE  SN74ACT244DW  [SOIC127P1030X265-20N]  206.04,81.26 0 top
VSLUE2  SN74ACT244DW  [SOIC127P1030X265-20N]  206.04,101.26 0 top
VSLUE3  SN74ACT244DW  [SOIC127P1030X265-20N]  206.04,121.26 0 top
VSLUE4  SN74ACT244DW  [SOIC127P1030X265-20N]  206.04,141.26 0 top
VSLUE5  SN74ACT244DW  [SOIC127P1030X265-20N]  145.04,101.26 0 top
VSLUE6  SN74ACT244DW  [SOIC127P1030X265-20N]  206.04,21.26 0 top
VSLUE7  SN74ACT244DW  [SOIC127P1030X265-20N]  145.04,121.26 0 top
VSLUE8  SN74ACT244DW  [SOIC127P1030X265-20N]  206.04,41.26 0 top
VSLUE9  SN74ACT244DW  [SOIC127P1030X265-20N]  145.04,141.26 0 top
VSLUE11  SN74ACT244DW  [SOIC127P1030X265-20N]  206.04,61.26 0 top